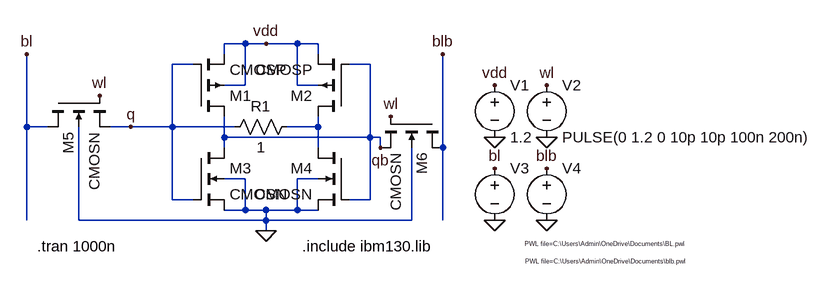
[diagram p0: schematic 6T CMOS.asc]
6T CMOS.asc, the LTspice schematic file:
Version 4
SHEET 1 1252 680
WIRE 96 32 64 32
WIRE 128 32 96 32
WIRE 176 32 128 32
WIRE 208 32 176 32
WIRE 64 48 64 32
WIRE 208 48 208 32
WIRE 16 64 -16 64
WIRE 288 64 256 64
WIRE 96 96 96 32
WIRE 96 96 64 96
WIRE 176 96 176 32
WIRE 208 96 176 96
WIRE -240 160 -240 48
WIRE -208 160 -240 160
WIRE -80 160 -112 160
WIRE -16 160 -16 64
WIRE -16 160 -80 160
WIRE 80 160 -16 160
WIRE 208 160 208 144
WIRE 208 160 160 160
WIRE 64 176 64 144
WIRE 288 176 288 64
WIRE 288 176 64 176
WIRE 304 176 288 176
WIRE 64 192 64 176
WIRE 208 192 208 160
WIRE 304 192 304 176
WIRE 400 192 400 48
WIRE 96 240 64 240
WIRE 208 240 176 240
WIRE -16 272 -16 160
WIRE 16 272 -16 272
WIRE 288 272 288 176
WIRE 288 272 256 272
WIRE 96 288 96 240
WIRE 96 288 64 288
WIRE 128 288 96 288
WIRE 176 288 176 240
WIRE 176 288 128 288
WIRE 208 288 176 288
WIRE -240 304 -240 160
WIRE -160 304 -160 160
WIRE 128 304 128 288
WIRE 128 304 -160 304
WIRE 352 304 352 192
WIRE 352 304 128 304
WIRE 400 304 400 192
WIRE 128 320 128 304
FLAG 128 320 0
FLAG -240 48 bl
FLAG 400 48 blb
FLAG 128 32 vdd
FLAG 320 144 wl
FLAG 480 96 vdd
FLAG 560 96 wl
FLAG 480 224 bl
FLAG 560 224 blb
FLAG 480 176 0
FLAG 560 176 0
FLAG 480 304 0
FLAG 560 304 0
FLAG 304 192 qb
FLAG -128 112 wl
FLAG -80 160 q
SYMBOL CMOSP 16 144 M180
SYMATTR InstName M1
SYMATTR Value2 l=130nm w=130nm
SYMBOL CMOSP 256 144 R180
SYMATTR InstName M2
SYMATTR Value2 l=130nm w=130nm
SYMBOL CMOSN 16 192 R0
SYMATTR InstName M3
SYMATTR Value2 l=130nm w=130nm
SYMBOL CMOSN 256 192 M0
SYMATTR InstName M4
SYMATTR Value2 l=130nm w=130nm
SYMBOL CMOSN -208 112 M90
SYMATTR InstName M5
SYMATTR Value2 l=130nm w=130nm
SYMBOL CMOSN 400 144 R90
SYMATTR InstName M6
SYMATTR Value2 l=130nm w=130nm
SYMBOL voltage 480 80 R0
WINDOW 123 0 0 Left 0
WINDOW 39 0 0 Left 0
SYMATTR InstName V1
SYMATTR Value 1.2
SYMBOL voltage 560 80 R0
WINDOW 123 0 0 Left 0
WINDOW 39 0 0 Left 0
SYMATTR InstName V2
SYMATTR Value PULSE(0 1.2 0 10p 10p 100n 200n)
SYMBOL voltage 480 208 R0
WINDOW 3 46 132 Left 0
WINDOW 123 0 0 Left 0
WINDOW 39 0 0 Left 0
SYMATTR Value PWL file=C:\Users\Admin\OneDrive\Documents\BL.pwl
SYMATTR InstName V3
SYMBOL voltage 560 208 R0
WINDOW 3 -33 159 Left 0
WINDOW 123 0 0 Left 0
WINDOW 39 0 0 Left 0
SYMATTR Value PWL file=C:\Users\Admin\OneDrive\Documents\blb.pwl
SYMATTR InstName V4
SYMBOL res 176 144 R90
WINDOW 0 0 56 VBottom 2
WINDOW 3 32 56 VTop 2
SYMATTR InstName R1
SYMATTR Value 1
TEXT -224 344 Left 2 !.tran 1000n
TEXT 184 344 Left 2 !.include ibm130.lib

The netlist it stands for:
* 6T CMOS.asc
M1 qb q vdd vdd CMOSP l=130nm w=130nm
M2 N001 qb vdd vdd CMOSP l=130nm w=130nm
M3 qb q 0 0 CMOSN l=130nm w=130nm
M4 N001 qb 0 0 CMOSN l=130nm w=130nm
M5 bl wl q 0 CMOSN l=130nm w=130nm
M6 blb wl qb 0 CMOSN l=130nm w=130nm
V1 vdd 0 1.2
V2 wl 0 PULSE(0 1.2 0 10p 10p 100n 200n)
V3 bl 0 PWL file=C:\Users\Admin\OneDrive\Documents\BL.pwl
V4 blb 0 PWL file=C:\Users\Admin\OneDrive\Documents\blb.pwl
R1 N001 q 1
.model NMOS NMOS
.model PMOS PMOS
.lib standard.mos
.tran 1000n
.include ibm130.lib
.backanno
.end